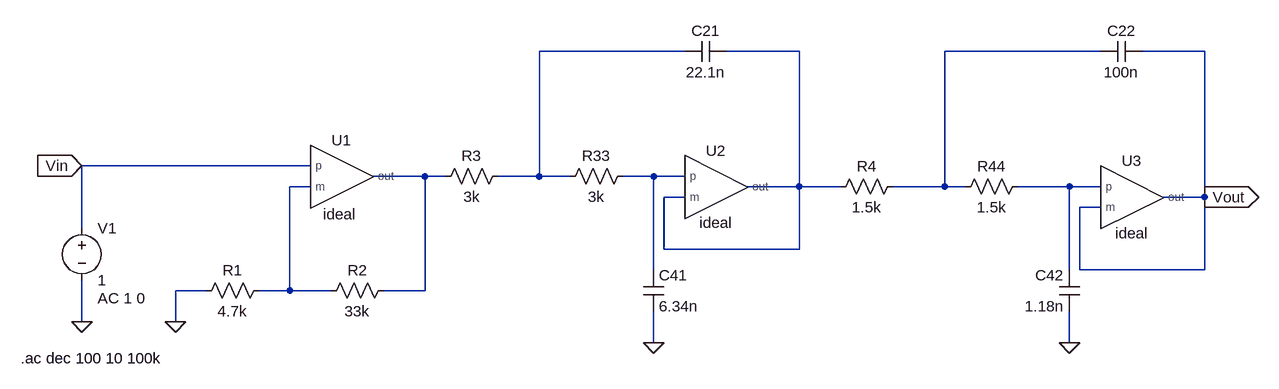
[diagram p0: schematic CommercialRCIdeal.asc]
CommercialRCIdeal.asc, the LTspice schematic file:
Version 4
SHEET 1 1360 680
WIRE 448 -32 224 -32
WIRE 624 -32 512 -32
WIRE 1088 -32 848 -32
WIRE 1248 -32 1152 -32
WIRE -128 144 -480 144
WIRE 48 160 -32 160
WIRE 80 160 48 160
WIRE 224 160 224 -32
WIRE 224 160 160 160
WIRE 272 160 224 160
WIRE 400 160 352 160
WIRE 448 160 400 160
WIRE -128 176 -160 176
WIRE 624 176 624 -32
WIRE 624 176 544 176
WIRE 688 176 624 176
WIRE 848 176 848 -32
WIRE 848 176 768 176
WIRE 880 176 848 176
WIRE 1040 176 960 176
WIRE 1088 176 1040 176
WIRE 448 192 416 192
WIRE 1248 192 1248 -32
WIRE 1248 192 1184 192
WIRE 1088 208 1056 208
WIRE -480 240 -480 144
WIRE 416 272 416 192
WIRE 624 272 624 176
WIRE 624 272 416 272
WIRE 400 304 400 160
WIRE 1040 304 1040 176
WIRE 1056 304 1056 208
WIRE 1248 304 1248 192
WIRE 1248 304 1056 304
WIRE -288 336 -336 336
WIRE -160 336 -160 176
WIRE -160 336 -208 336
WIRE -96 336 -160 336
WIRE 48 336 48 160
WIRE 48 336 -16 336
WIRE -480 384 -480 320
WIRE -336 384 -336 336
WIRE 400 416 400 368
WIRE 1040 416 1040 368
FLAG 1040 416 0
FLAG 400 416 0
FLAG -336 384 0
FLAG -480 384 0
FLAG 1248 192 Vout
IOPIN 1248 192 Out
FLAG -480 144 Vin
IOPIN -480 144 In
SYMBOL AutoGenerated\\ideal -80 160 R0
WINDOW 3 -3 43 Top 2
WINDOW 39 0 64 Invisible 2
SYMATTR InstName U1
SYMBOL AutoGenerated\\ideal 496 176 R0
WINDOW 39 0 64 Invisible 2
SYMATTR InstName U2
SYMBOL AutoGenerated\\ideal 1136 192 R0
WINDOW 39 0 64 Invisible 2
SYMATTR InstName U3
SYMBOL res -192 320 R90
WINDOW 0 0 56 VBottom 2
WINDOW 3 32 56 VTop 2
SYMATTR InstName R1
SYMATTR Value 4.7k
SYMBOL res 0 320 R90
WINDOW 0 0 56 VBottom 2
WINDOW 3 32 56 VTop 2
SYMATTR InstName R2
SYMATTR Value 33k
SYMBOL res 176 144 R90
WINDOW 0 0 56 VBottom 2
WINDOW 3 32 56 VTop 2
SYMATTR InstName R3
SYMATTR Value 3k
SYMBOL res 368 144 R90
WINDOW 0 0 56 VBottom 2
WINDOW 3 32 56 VTop 2
SYMATTR InstName R33
SYMATTR Value 3k
SYMBOL res 784 160 R90
WINDOW 0 0 56 VBottom 2
WINDOW 3 32 56 VTop 2
SYMATTR InstName R4
SYMATTR Value 1.5k
SYMBOL res 976 160 R90
WINDOW 0 0 56 VBottom 2
WINDOW 3 32 56 VTop 2
SYMATTR InstName R44
SYMATTR Value 1.5k
SYMBOL cap 384 304 R0
SYMATTR InstName C41
SYMATTR Value 6.34n
SYMBOL cap 512 -48 R90
WINDOW 0 0 32 VBottom 2
WINDOW 3 32 32 VTop 2
SYMATTR InstName C21
SYMATTR Value 22.1n
SYMBOL cap 1152 -48 R90
WINDOW 0 0 32 VBottom 2
WINDOW 3 32 32 VTop 2
SYMATTR InstName C22
SYMATTR Value 100n
SYMBOL cap 1056 368 R180
WINDOW 0 24 56 Left 2
WINDOW 3 24 8 Left 2
SYMATTR InstName C42
SYMATTR Value 1.18n
SYMBOL voltage -480 224 R0
WINDOW 123 24 124 Left 2
WINDOW 39 0 0 Left 0
SYMATTR InstName V1
SYMATTR Value 1
SYMATTR Value2 AC 1 0
TEXT -574 440 Left 2 !.ac dec 100 10 100k

The netlist it stands for:
* CommercialRCIdeal.asc
XU1 Vin N006 N004 ideal Rin=1e9, Rout=1, A=1e9  ; pins p m out
XU2 N005 N002 N002 ideal Rin=1e9, Rout=1, A=1e9  ; pins p m out
XU3 N007 Vout Vout ideal Rin=1e9, Rout=1, A=1e9  ; pins p m out
R1 N006 0 4.7k
R2 N004 N006 33k
R3 N001 N004 3k
R33 N005 N001 3k
R4 N003 N002 1.5k
R44 N007 N003 1.5k
C41 N005 0 6.34n
C21 N002 N001 22.1n
C22 Vout N003 100n
C42 0 N007 1.18n
V1 Vin 0 1 AC 1 0
.ac dec 100 10 100k
.lib C:\Users\andre\Desktop\Universita\PrimoAnno\SecondoSemestre\ProgettiAnalogici\FilterProject\LTspice\opamp.lib
.backanno
.end